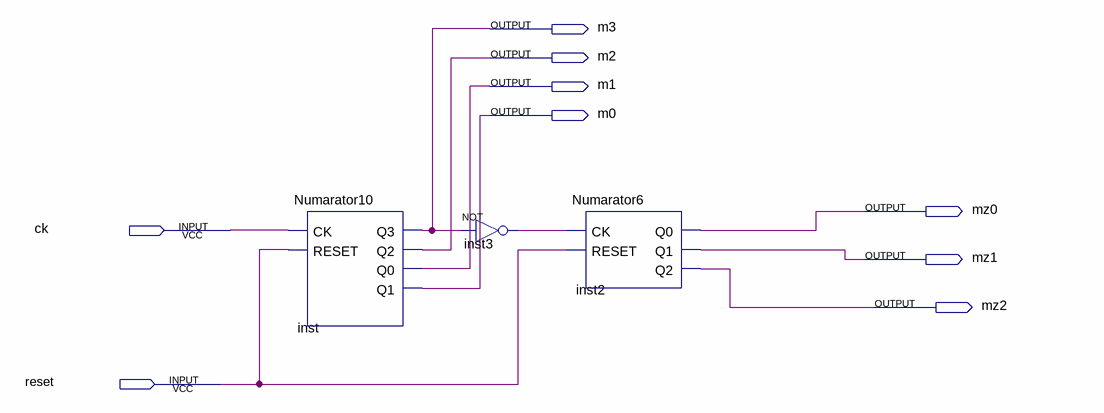
[diagram p0: schematic sheet]
// Quartus schematic numMin.bdf as structural Verilog: 3 symbols, 9 pins
module numMin (
  input  ck,
  input  reset,
  output m3,
  output m2,
  output m1,
  output m0,
  output mz0,
  output mz1,
  output mz2
);

  wire inst3_out;

  Numarator10 inst (.CK(ck), .RESET(reset), .Q3(m3), .Q2(m2), .Q0(m1), .Q1(m0));
  not inst3 (inst3_out, m3);
  Numarator6 inst2 (.CK(inst3_out), .RESET(reset), .Q0(mz0), .Q1(mz1), .Q2(mz2));
endmodule
